# EAGLE design encoder-switch-type2-tht (EAGLE 9.2.0)
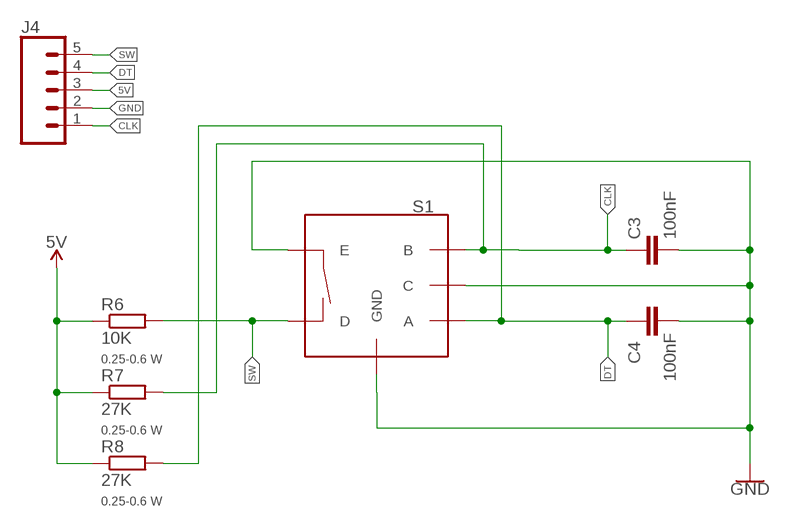
[diagram p0: schematic, sheet 1]

## Parts
C3  100nF  CAPACITOR_1025-024X044  [C025-024X044]
C4  100nF  CAPACITOR_1025-024X044  [C025-024X044]
J4  CONN_051X05LA  [1X05/90]
R6  10K  RESISTOR0204/2V  [0204V]
R7  27K  RESISTOR0204/2V  [0204V]
R8  27K  RESISTOR0204/2V  [0204V]
S1  ENCODER_SWITCH  [ROTARY_ENC_PLAIN]

## Nets
5V: J4.3 R6.1 R7.1 R8.1
CLK: C3.1 J4.1 R7.2 S1.B
DT: C4.1 J4.4 R8.2 S1.A
GND: C3.2 C4.2 J4.2 S1.C S1.E S1.GND1(GND) S1.GND2(GND)
SW: J4.5 R6.2 S1.D

## Library data of the parts
C3 C4 = 006-rcl:CAPACITOR_1: CAPACITOR, European symbol; SPICEPREFIX: C
J4 = 001-private-inventory:CONN_05: Multi connection point. Often used as Generic Header-pin footprint for 0.1 inch spaced/style header connections On any of the 0.1 inch spaced packages, you can populate with these: Break Away Headers - Straight <https://www.sparkfun.com/products/116> (PRT-00116) Break Away Male Headers - Right Angle <https://www.sparkfun.com/products/553> (PRT-00553) Female Headers <https://www.sparkfun.com/products/115> (PRT-00115) Break Away Headers - Machine Pin <https://www.sparkfun.com/products/117> (PRT-00117) Break Away Female Headers - Swiss Machine Pin <https://www.sparkfun.com/products/743> (PRT-00743) For SCREWTERMINALS and SPRING TERMINALS visit here: Screw Terimnals on SparkFun.com <https://www.sparkfun.com/search/results?term=Screw+Terminals> (5mm/3.5mm/2.54mm spacing) This device is also useful as a general connection point to wire up your design to another part of your project. Our various solder wires solder well into these plated through hole pads. Hook-Up Wire - Assortment (Stranded, 22 AWG) <https://www.sparkfun.com/products/11375> (PRT-11375) Hook-Up Wire - Assortment (Solid Core, 22 AWG) <https://www.sparkfun.com/products/11367> (PRT-11367) View the entire wire category on our website here <https://www.sparkfun.com/categories/141> Special notes: Molex polarized connector foot print use with SKU : PRT-08231 with associated crimp pins and housings. 1MM SMD Version SKU: PRT-10208
R6-R8 = 006-rcl:RESISTOR: RESISTOR, European symbol; POWER: 0.25-0.6 W; SPICEPREFIX: R
S1 = 010-inputs:ENCODER_SWITCH: Rotary Encoder w/ Select Switch Encoders rotate similarly to potentiometers, but they’re different from potentiometers in that an encoder has full rotation without limits. They output gray code so that you can tell how much and in which direction the encoder has been turned. This encoder includes a push-down select switch built into the shaft. SparkFun Products Rotary Encoder <https://www.sparkfun.com/products/9117> (COM-09117); SF_SKU: COM-09117

## Board
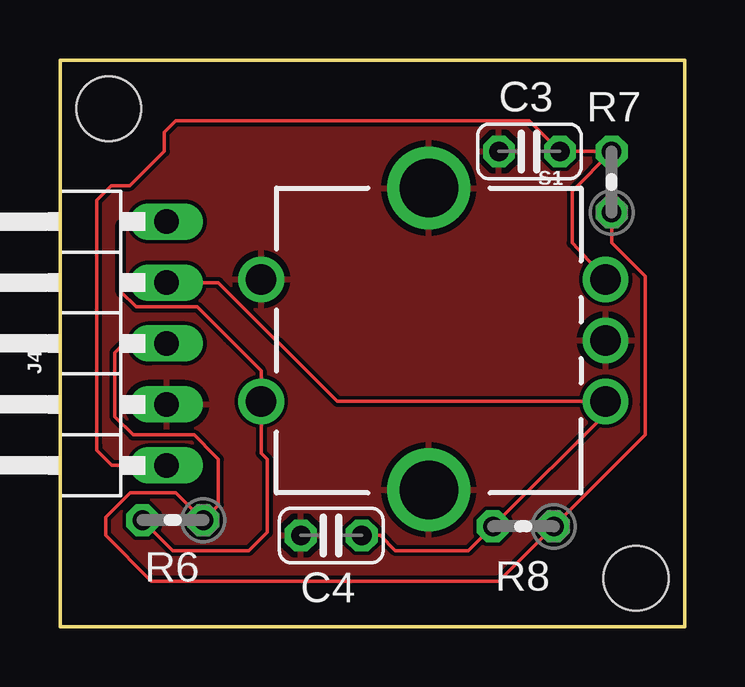
[diagram p1: board, top side]

Size 26.04 x 23.62 mm. Coordinates in mm from the lower left corner, seen from the top.
Outline: 26.04,0 0,0 0,23.62 26.04,23.62 26.04,0
Copper layers (1*16): Top 0.035mm / dielectric 1.5mm / Bottom 0.035mm
Design rules "default": minimum track width 6mil, minimum drill 0.35mm, track to track 6mil, track to pad 6mil, pad to pad 6mil, via to via 6mil, smd to smd 6mil, copper to edge 40mil, drill to drill 6mil, minimum pad ring 10mil, minimum via ring 8mil, stop-mask expansion 4mil, vias tented up to drill 0mil, thermal gap 10mil
Holes 2.7 mm at 2.03,21.59 24,2.03

### Footprints (pad centres in the part's own frame; a part is rotated, then mirrored left to right if it is on the bottom)
C025-024X044 = drill 0.813 octagon: 1 -1.27,0; 2 1.27,0
1X05/90 = drill 1.016 long: 1 -5.08,-3.81; 2 -2.54,-3.81; 3 0,-3.81; 4 2.54,-3.81; 5 5.08,-3.81
0204V = drill 0.813 octagon: 1 -1.27,0; 2 1.27,0
ROTARY_ENC_PLAIN = drill 1.27: A 7.366,-2.54; B 7.366,2.54; C 7.366,0; D -6.985,-2.54; E -6.985,2.54 | drill 2.438: GND1 0,6.35; GND2 0,-6.223

### Placement (x,y rotation side)
C3  19.56,19.81 180 top
C4  11.3,3.81 180 top
J4  0.64,11.81 90 top
R6  4.7,4.45 180 top
R7  22.99,18.54 90 top
R8  19.3,4.19 180 top
S1  15.37,11.94 0 top

### Tracks (layer width: path | path; a pad name or v marks a point on that pad's centre or on a via)
5V
  Top 0.152: R7.1 22.99,16 24.38,14.6 24.38,9.27 24.38,8 R8.1 18.29,1.91 3.81,1.91 1.91,3.81 1.91,4.57 2.92,5.59 4.83,5.59 R6.1 6.6,5.08 6.6,6.99 6.48,7.11 5.59,8 3.05,8 2.29,8.76 2.29,11.43 2.67,11.81 J4.3
CLK
  Top 0.152: S1.B 21.34,16 21.34,18.16 R7.2 20.95,19.81 C3.1 19.56,21.08 4.83,21.08 4.35,20.6 4.35,19.82 2.92,18.39 2.13,18.39 1.52,17.78 1.52,7.62 1.52,7.37 2.16,6.73 J4.1
DT
  Top 0.152: C4.1 13.33,3.81 13.97,3.17 17.02,3.17 R8.2 22.86,9.02 S1.A 11.56,9.4 6.6,14.35 J4.4
GND
  pour Top: 0,23.62 0,0 26.04,0 26.04,23.62
SW
  Top 0.152: R6.2 4.7,3.17 7.87,3.17 8.64,3.94 8.64,6.99 8.38,7.24 S1.D 8.38,10.67 7.11,11.94 6.98,12.06 5.71,13.33 3.17,13.33 2.54,13.97 2.54,16.76 2.67,16.89 J4.5